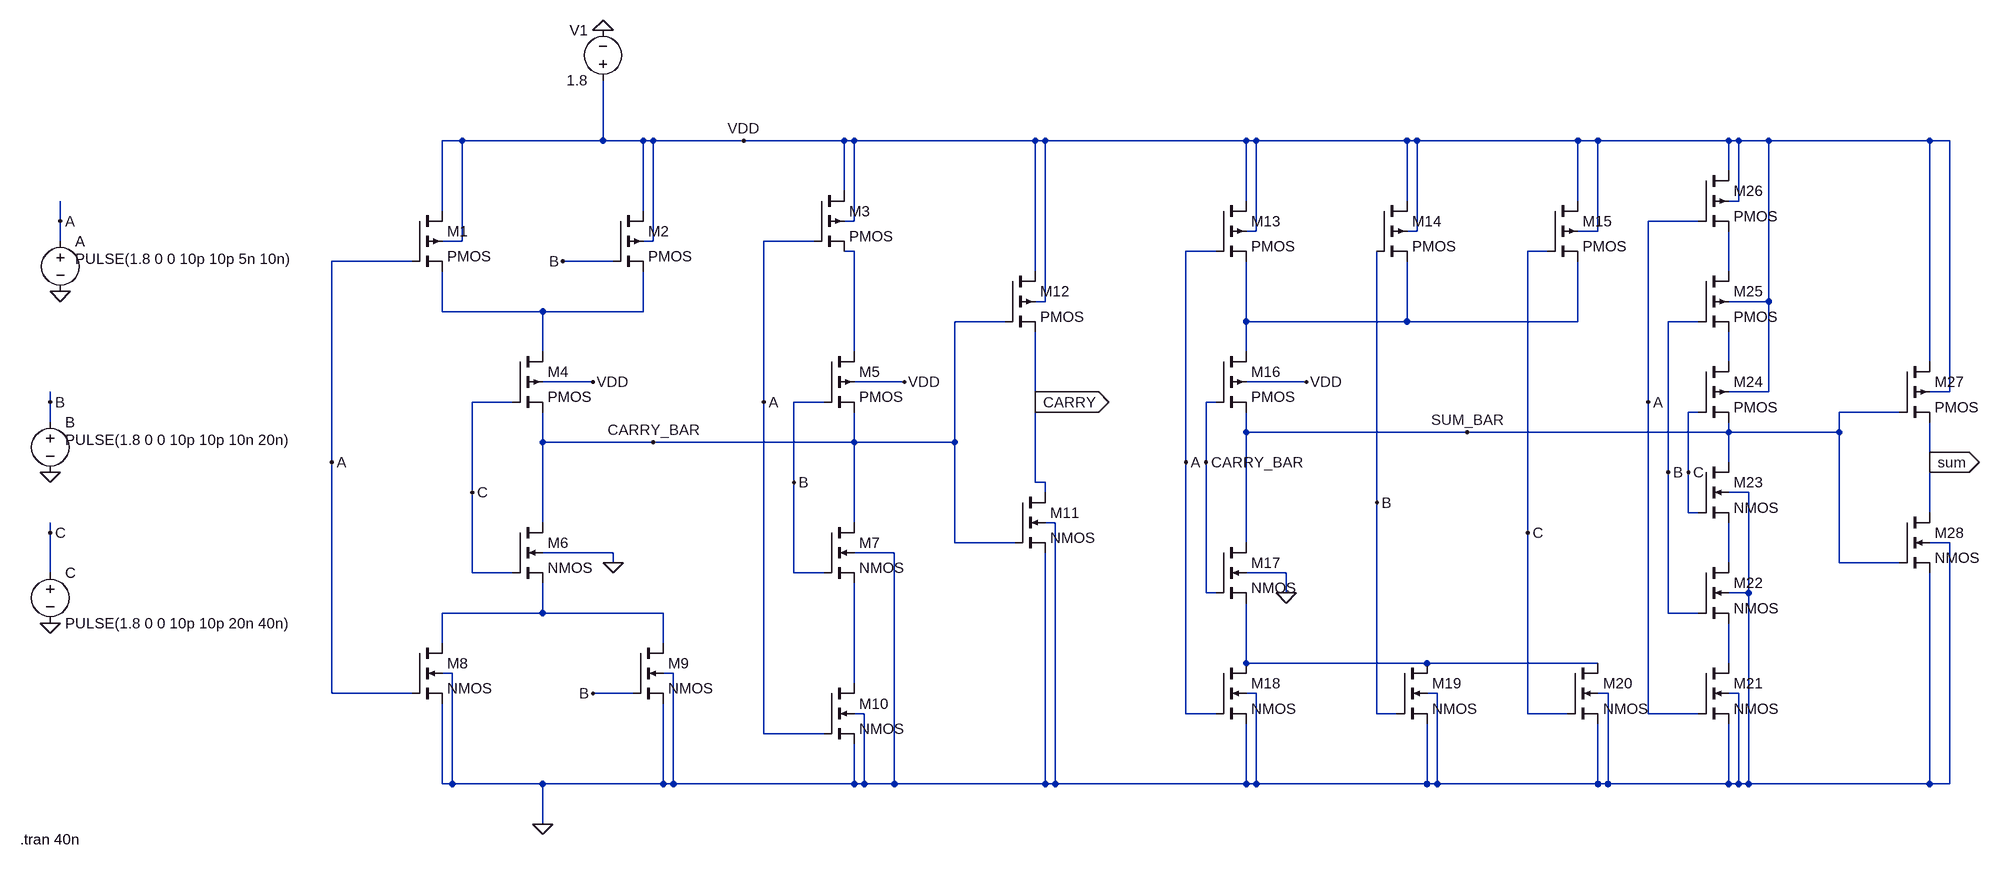
[diagram p0: schematic EXPADDER.asc]
EXPADDER.asc, the LTspice schematic file:
Version 4
SHEET 1 2324 1112
WIRE -96 -16 -128 -16
WIRE 128 -16 128 -112
WIRE 128 -16 -96 -16
WIRE 192 -16 128 -16
WIRE 208 -16 192 -16
WIRE 352 -16 208 -16
WIRE 512 -16 352 -16
WIRE 528 -16 512 -16
WIRE 816 -16 528 -16
WIRE 832 -16 816 -16
WIRE 1152 -16 832 -16
WIRE 1168 -16 1152 -16
WIRE 1408 -16 1168 -16
WIRE 1424 -16 1408 -16
WIRE 1680 -16 1424 -16
WIRE 1712 -16 1680 -16
WIRE 1920 -16 1712 -16
WIRE 1936 -16 1920 -16
WIRE 1984 -16 1936 -16
WIRE 2240 -16 1984 -16
WIRE 2272 -16 2240 -16
WIRE 1920 32 1920 -16
WIRE 512 64 512 -16
WIRE 1152 80 1152 -16
WIRE 1408 80 1408 -16
WIRE 1680 80 1680 -16
WIRE 1936 80 1936 -16
WIRE 1936 80 1920 80
WIRE -128 96 -128 -16
WIRE 192 96 192 -16
WIRE -736 112 -736 80
WIRE 528 112 528 -16
WIRE 528 112 512 112
WIRE 1872 112 1792 112
WIRE 1168 128 1168 -16
WIRE 1168 128 1152 128
WIRE 1424 128 1424 -16
WIRE 1424 128 1408 128
WIRE 1712 128 1712 -16
WIRE 1712 128 1680 128
WIRE -736 144 -736 112
WIRE -96 144 -96 -16
WIRE -96 144 -128 144
WIRE 208 144 208 -16
WIRE 208 144 192 144
WIRE 464 144 384 144
WIRE 528 160 512 160
WIRE 1104 160 1056 160
WIRE 1632 160 1600 160
WIRE -176 176 -304 176
WIRE 144 176 64 176
WIRE 816 192 816 -16
WIRE 1920 192 1920 128
WIRE 832 240 832 -16
WIRE 832 240 816 240
WIRE 1984 240 1984 -16
WIRE 1984 240 1920 240
WIRE -128 256 -128 192
WIRE 32 256 -128 256
WIRE 192 256 192 192
WIRE 192 256 32 256
WIRE 768 272 688 272
WIRE 1152 272 1152 176
WIRE 1408 272 1408 176
WIRE 1408 272 1152 272
WIRE 1680 272 1680 176
WIRE 1680 272 1408 272
WIRE 1872 272 1824 272
WIRE 32 320 32 256
WIRE 528 320 528 160
WIRE 1152 320 1152 272
WIRE 1920 336 1920 288
WIRE 2240 336 2240 -16
WIRE 112 368 32 368
WIRE 608 368 528 368
WIRE 1248 368 1152 368
WIRE 1984 384 1984 240
WIRE 1984 384 1920 384
WIRE 2272 384 2272 -16
WIRE 2272 384 2240 384
WIRE -752 400 -752 384
WIRE -16 400 -80 400
WIRE 384 400 384 144
WIRE 480 400 432 400
WIRE 816 400 816 288
WIRE 1104 400 1088 400
WIRE 1792 400 1792 112
WIRE 1872 416 1856 416
WIRE 2192 416 2096 416
WIRE -752 432 -752 400
WIRE 1152 448 1152 416
WIRE 1504 448 1152 448
WIRE 1920 448 1920 432
WIRE 1920 448 1504 448
WIRE 2096 448 2096 416
WIRE 2096 448 1920 448
WIRE 32 464 32 416
WIRE 208 464 32 464
WIRE 528 464 528 416
WIRE 528 464 208 464
WIRE 688 464 688 272
WIRE 688 464 528 464
WIRE -304 496 -304 176
WIRE 1056 496 1056 160
WIRE 1088 496 1088 400
WIRE 1920 496 1920 448
WIRE 2240 496 2240 432
WIRE 1824 512 1824 272
WIRE 1856 512 1856 416
WIRE 432 528 432 400
WIRE 816 528 816 400
WIRE 832 528 816 528
WIRE -80 544 -80 400
WIRE 832 544 832 528
WIRE 1952 544 1920 544
WIRE 1360 560 1360 160
WIRE 1856 576 1856 512
WIRE 1872 576 1856 576
WIRE 2240 576 2240 496
WIRE 32 592 32 464
WIRE 528 592 528 464
WIRE 848 592 832 592
WIRE -752 608 -752 592
WIRE 1600 608 1600 160
WIRE 688 624 688 464
WIRE 784 624 688 624
WIRE 1152 624 1152 448
WIRE 2272 624 2240 624
WIRE 144 640 32 640
WIRE 592 640 528 640
WIRE 144 656 144 640
WIRE 1920 656 1920 592
WIRE 2096 656 2096 448
WIRE 2192 656 2096 656
WIRE -752 672 -752 608
WIRE -80 672 -80 544
WIRE -16 672 -80 672
WIRE 432 672 432 528
WIRE 480 672 432 672
WIRE 1216 672 1152 672
WIRE 1088 704 1088 496
WIRE 1104 704 1088 704
WIRE 1216 704 1216 672
WIRE 1952 704 1952 544
WIRE 1952 704 1920 704
WIRE 32 736 32 688
WIRE 32 736 -128 736
WIRE 224 736 32 736
WIRE 1824 736 1824 512
WIRE 1872 736 1824 736
WIRE -128 784 -128 736
WIRE 224 784 224 736
WIRE 1152 816 1152 720
WIRE 1440 816 1152 816
WIRE 1712 816 1440 816
WIRE 1920 816 1920 752
WIRE -112 832 -128 832
WIRE 240 832 224 832
WIRE 528 848 528 688
WIRE -304 864 -304 496
WIRE -176 864 -304 864
WIRE 176 864 112 864
WIRE 1168 864 1152 864
WIRE 1456 864 1440 864
WIRE 1728 864 1712 864
WIRE 1936 864 1920 864
WIRE 544 896 528 896
WIRE 1056 896 1056 496
WIRE 1104 896 1056 896
WIRE 1360 896 1360 560
WIRE 1392 896 1360 896
WIRE 1600 896 1600 608
WIRE 1664 896 1600 896
WIRE 1792 896 1792 400
WIRE 1872 896 1792 896
WIRE 384 928 384 400
WIRE 480 928 384 928
WIRE -128 1008 -128 880
WIRE -112 1008 -112 832
WIRE -112 1008 -128 1008
WIRE 32 1008 -112 1008
WIRE 224 1008 224 880
WIRE 224 1008 32 1008
WIRE 240 1008 240 832
WIRE 240 1008 224 1008
WIRE 528 1008 528 944
WIRE 528 1008 240 1008
WIRE 544 1008 544 896
WIRE 544 1008 528 1008
WIRE 592 1008 592 640
WIRE 592 1008 544 1008
WIRE 832 1008 832 640
WIRE 832 1008 592 1008
WIRE 848 1008 848 592
WIRE 848 1008 832 1008
WIRE 1152 1008 1152 912
WIRE 1152 1008 848 1008
WIRE 1168 1008 1168 864
WIRE 1168 1008 1152 1008
WIRE 1440 1008 1440 912
WIRE 1440 1008 1168 1008
WIRE 1456 1008 1456 864
WIRE 1456 1008 1440 1008
WIRE 1712 1008 1712 912
WIRE 1712 1008 1456 1008
WIRE 1728 1008 1728 864
WIRE 1728 1008 1712 1008
WIRE 1920 1008 1920 912
WIRE 1920 1008 1728 1008
WIRE 1936 1008 1936 864
WIRE 1936 1008 1920 1008
WIRE 1952 1008 1952 704
WIRE 1952 1008 1936 1008
WIRE 2240 1008 2240 672
WIRE 2240 1008 1952 1008
WIRE 2272 1008 2272 624
WIRE 2272 1008 2240 1008
WIRE 32 1072 32 1008
FLAG 144 656 0
FLAG 32 1072 0
FLAG -736 112 A
FLAG -752 400 B
FLAG 64 176 B
FLAG -752 608 C
FLAG -304 496 A
FLAG 384 400 A
FLAG -80 544 C
FLAG 112 864 B
FLAG 432 528 B
FLAG 112 368 VDD
FLAG 608 368 VDD
FLAG 816 400 CARRY
IOPIN 816 400 Out
FLAG 1216 704 0
FLAG 1248 368 VDD
FLAG 1360 560 B
FLAG 1600 608 C
FLAG 1056 496 A
FLAG 2240 496 sum
IOPIN 2240 496 Out
FLAG 352 -16 VDD
FLAG 1792 400 A
FLAG 1824 512 B
FLAG 1856 512 C
FLAG 128 -192 0
FLAG -752 512 0
FLAG -736 224 0
FLAG -752 752 0
FLAG 208 464 CARRY_BAR
FLAG 1088 496 CARRY_BAR
FLAG 1504 448 SUM_BAR
SYMBOL pmos4 -176 96 R0
SYMATTR InstName M1
SYMBOL pmos4 144 96 R0
SYMATTR InstName M2
SYMBOL pmos4 464 64 R0
SYMATTR InstName M3
SYMBOL pmos4 -16 320 R0
SYMATTR InstName M4
SYMBOL pmos4 480 320 R0
SYMATTR InstName M5
SYMBOL nmos4 -16 592 R0
SYMATTR InstName M6
SYMBOL nmos4 480 592 R0
SYMATTR InstName M7
SYMBOL nmos4 -176 784 R0
SYMATTR InstName M8
SYMBOL nmos4 176 784 R0
SYMATTR InstName M9
SYMBOL nmos4 480 848 R0
SYMATTR InstName M10
SYMBOL nmos4 784 544 R0
SYMATTR InstName M11
SYMBOL pmos4 768 192 R0
SYMATTR InstName M12
SYMBOL voltage -752 416 R0
WINDOW 3 24 44 Left 2
WINDOW 123 0 0 Left 0
WINDOW 39 0 0 Left 0
SYMATTR Value PULSE(1.8 0 0 10p 10p 10n 20n)
SYMATTR InstName B
SYMBOL voltage -752 656 R0
WINDOW 123 0 0 Left 0
WINDOW 39 0 0 Left 0
SYMATTR InstName C
SYMATTR Value PULSE(1.8 0 0 10p 10p 20n 40n)
SYMBOL voltage -736 128 R0
WINDOW 3 24 44 Left 2
WINDOW 123 0 0 Left 0
WINDOW 39 0 0 Left 0
SYMATTR Value PULSE(1.8 0 0 10p 10p 5n 10n)
SYMATTR InstName A
SYMBOL pmos4 1104 80 R0
SYMATTR InstName M13
SYMBOL pmos4 1360 80 R0
SYMATTR InstName M14
SYMBOL pmos4 1632 80 R0
SYMATTR InstName M15
SYMBOL pmos4 1104 320 R0
SYMATTR InstName M16
SYMBOL nmos4 1104 624 R0
SYMATTR InstName M17
SYMBOL nmos4 1104 816 R0
SYMATTR InstName M18
SYMBOL nmos4 1392 816 R0
SYMATTR InstName M19
SYMBOL nmos4 1664 816 R0
SYMATTR InstName M20
SYMBOL nmos4 1872 816 R0
SYMATTR InstName M21
SYMBOL nmos4 1872 656 R0
SYMATTR InstName M22
SYMBOL nmos4 1872 496 R0
SYMATTR InstName M23
SYMBOL pmos4 1872 336 R0
SYMATTR InstName M24
SYMBOL pmos4 1872 192 R0
SYMATTR InstName M25
SYMBOL pmos4 1872 32 R0
SYMATTR InstName M26
SYMBOL pmos4 2192 336 R0
SYMATTR InstName M27
SYMBOL nmos4 2192 576 R0
SYMATTR InstName M28
SYMBOL voltage 128 -96 R180
WINDOW 0 24 96 Left 2
WINDOW 3 24 16 Left 2
WINDOW 123 0 0 Left 0
WINDOW 39 0 0 Left 0
SYMATTR InstName V1
SYMATTR Value 1.8
TEXT -800 1096 Left 2 !.tran 40n

The netlist it stands for:
* EXPADDER.asc
M1 VDD A N003 VDD PMOS
M2 VDD B N003 VDD PMOS
M3 VDD A N001 VDD PMOS
M4 N003 C CARRY_BAR VDD PMOS
M5 N001 B CARRY_BAR VDD PMOS
M6 CARRY_BAR C N007 0 NMOS
M7 CARRY_BAR B N010 0 NMOS
M8 N007 A 0 0 NMOS
M9 N007 B 0 0 NMOS
M10 N010 A 0 0 NMOS
M11 CARRY CARRY_BAR 0 0 NMOS
M12 VDD CARRY_BAR CARRY VDD PMOS
V§B B 0 PULSE(1.8 0 0 10p 10p 10n 20n)
V§C C 0 PULSE(1.8 0 0 10p 10p 20n 40n)
V§A A 0 PULSE(1.8 0 0 10p 10p 5n 10n)
M13 VDD A N004 VDD PMOS
M14 VDD B N004 VDD PMOS
M15 VDD C N004 VDD PMOS
M16 N004 CARRY_BAR SUM_BAR VDD PMOS
M17 SUM_BAR CARRY_BAR N008 0 NMOS
M18 N008 A 0 0 NMOS
M19 N008 B 0 0 NMOS
M20 N008 C 0 0 NMOS
M21 N009 A 0 0 NMOS
M22 N006 B N009 0 NMOS
M23 SUM_BAR C N006 0 NMOS
M24 N005 C SUM_BAR VDD PMOS
M25 N002 B N005 VDD PMOS
M26 VDD A N002 VDD PMOS
M27 VDD SUM_BAR sum VDD PMOS
M28 sum SUM_BAR 0 0 NMOS
V1 VDD 0 1.8
.model NMOS NMOS
.model PMOS PMOS
.lib standard.mos
.tran 40n
.backanno
.end